# Altium schematic sheet main.SchDoc
size A4; SheetNumber: 1; SheetTotal: 5
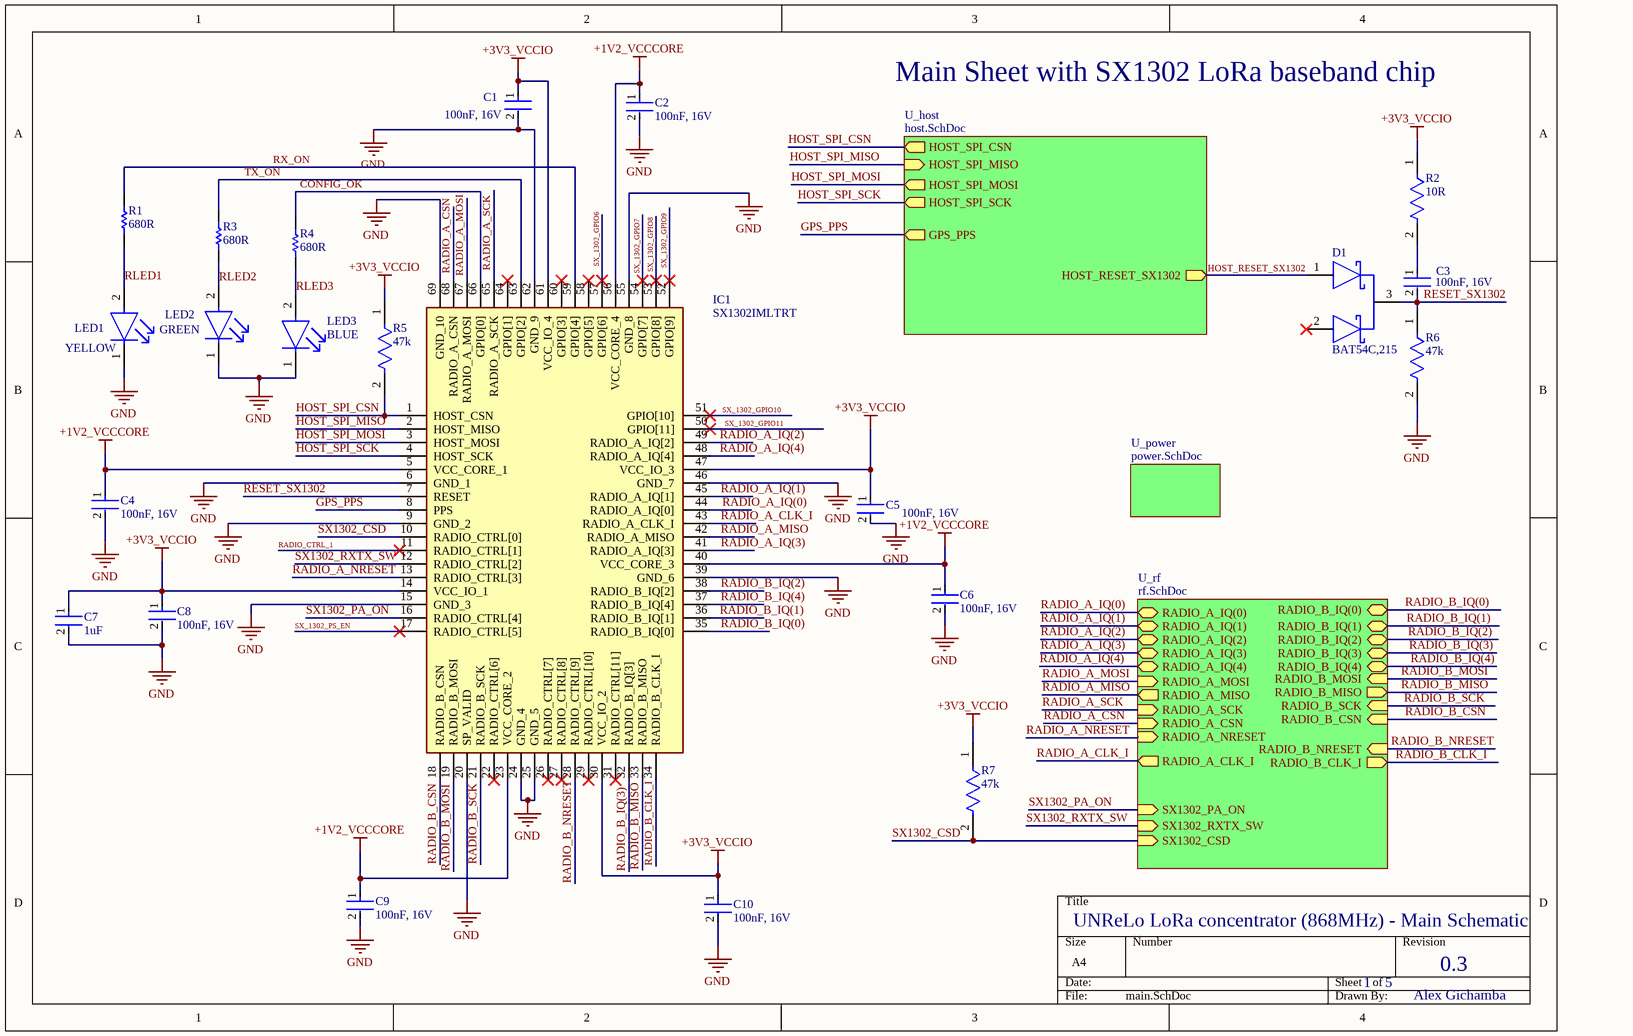
[diagram p0: main.SchDoc]

## Parts
C1  100nF, 16V  [FP-CC0603-DA-MFG]
C2  100nF, 16V  [FP-CC0603-DA-MFG]
C3  100nF, 16V  [FP-CC0603-DA-MFG]
C4  100nF, 16V  [FP-CC0603-DA-MFG]
C5  100nF, 16V  [FP-CC0603-DA-MFG]
C6  100nF, 16V  [FP-CC0603-DA-MFG]
C7  1uF  [FP-CL21-IPC_A]
C8  100nF, 16V  [FP-CC0603-DA-MFG]
C9  100nF, 16V  [FP-CC0603-DA-MFG]
C10  100nF, 16V  [FP-CC0603-DA-MFG]
D1  BAT54C,215  [FP-SOT23-MFG]
IC1  SX1302IMLTRT  [QFN35P700X700X80-69N-D]
LED1  YELLOW  [FP-SML-D12-MFG]
LED2  GREEN  [FP-LTST-C171GKT-MFG]
LED3  BLUE  [FP-6_541-5094_01-4-MFG]
R1  680R  [RESC2013X70X40ML20T20]
R2  10R  [FP-ERJ3EK-MFG]
R3  680R  [RESC2013X70X40ML20T20]
R4  680R  [RESC2013X70X40ML20T20]
R5  47k  [FP-RMCF0805-IPC_B]
R6  47k  [FP-RMCF0805-IPC_B]
R7  47k  [FP-RMCF0805-IPC_B]

## Sub-sheets
U_host = host.SchDoc: HOST_SPI_MOSI (out), HOST_SPI_MISO (in), HOST_SPI_CSN (out), HOST_SPI_SCK (out), HOST_RESET_SX1302 (out), GPS_PPS (out)
U_power = power.SchDoc: no entries
U_rf = rf.SchDoc: RADIO_A_IQ(0) (bidir), RADIO_A_IQ(1) (bidir), RADIO_A_IQ(4) (bidir), RADIO_A_IQ(3) (bidir), RADIO_A_IQ(2) (bidir), RADIO_B_IQ(2) (bidir), RADIO_B_IQ(4) (bidir), RADIO_B_IQ(1) (bidir), RADIO_B_IQ(0) (bidir), RADIO_B_IQ(3) (bidir), RADIO_A_SCK (in), RADIO_A_MOSI (in), RADIO_A_MISO (out), RADIO_A_NRESET (in), RADIO_A_CSN (in), RADIO_B_CSN (in), RADIO_B_SCK (in), RADIO_B_MOSI (in), RADIO_B_MISO (out), RADIO_B_NRESET (in), SX1302_CSD (in), SX1302_RXTX_SW (in), SX1302_PA_ON (in), RADIO_B_CLK_I (out), RADIO_A_CLK_I (out)

## Nets
+1V2_VCCCORE: C2.1 C4.1 C6.1 C9.1 IC1.5(VCC_CORE_1) IC1.23(VCC_CORE_2) IC1.40(VCC_CORE_3) IC1.56(VCC_CORE_4)
+3V3_VCCIO: C1.1 C5.1 C7.1 C8.1 C10.1 IC1.14(VCC_IO_1) IC1.30(VCC_IO_2) IC1.47(VCC_IO_3) IC1.61(VCC_IO_4) R2.1 R5.1 R7.1
GND: C1.2 C2.2 C4.2 C5.2 C6.2 C7.2 C8.2 C9.2 C10.2 IC1.6(GND_1) IC1.9(GND_2) IC1.15(GND_3) IC1.20(SP_VALID) IC1.24(GND_4) IC1.25(GND_5) IC1.39(GND_6) IC1.46(GND_7) IC1.55(GND_8) IC1.62(GND_9) IC1.69(GND_10) LED1.1(C) LED2.1(C) LED3.1(C) R6.2
CONFIG_OK: IC1.66(GPIO[0]) R4.2
GPS_PPS: IC1.8(PPS) ; sheet U_host/GPS_PPS
HOST_RESET_SX1302: D1.1(1_ANODE) ; sheet U_host/HOST_RESET_SX1302
HOST_SPI_CSN: IC1.1(HOST_CSN) R5.2 ; sheet U_host/HOST_SPI_CSN
HOST_SPI_MISO: IC1.2(HOST_MISO) ; sheet U_host/HOST_SPI_MISO
HOST_SPI_MOSI: IC1.3(HOST_MOSI) ; sheet U_host/HOST_SPI_MOSI
HOST_SPI_SCK: IC1.4(HOST_SCK) ; sheet U_host/HOST_SPI_SCK
RADIO_A_CLK_I: IC1.43(RADIO_A_CLK_I) ; sheet U_rf/RADIO_A_CLK_I
RADIO_A_CSN: IC1.68(RADIO_A_CSN) ; sheet U_rf/RADIO_A_CSN
RADIO_A_IQ(0): IC1.44(RADIO_A_IQ[0]) ; sheet U_rf/RADIO_A_IQ(0)
RADIO_A_IQ(1): IC1.45(RADIO_A_IQ[1]) ; sheet U_rf/RADIO_A_IQ(1)
RADIO_A_IQ(2): IC1.49(RADIO_A_IQ[2]) ; sheet U_rf/RADIO_A_IQ(2)
RADIO_A_IQ(3): IC1.41(RADIO_A_IQ[3]) ; sheet U_rf/RADIO_A_IQ(3)
RADIO_A_IQ(4): IC1.48(RADIO_A_IQ[4]) ; sheet U_rf/RADIO_A_IQ(4)
RADIO_A_MISO: IC1.42(RADIO_A_MISO) ; sheet U_rf/RADIO_A_MISO
RADIO_A_MOSI: IC1.67(RADIO_A_MOSI) ; sheet U_rf/RADIO_A_MOSI
RADIO_A_NRESET: IC1.13(RADIO_CTRL[3]) ; sheet U_rf/RADIO_A_NRESET
RADIO_A_SCK: IC1.65(RADIO_A_SCK) ; sheet U_rf/RADIO_A_SCK
RADIO_B_CLK_I: IC1.34(RADIO_B_CLK_I) ; sheet U_rf/RADIO_B_CLK_I
RADIO_B_CSN: IC1.18(RADIO_B_CSN) ; sheet U_rf/RADIO_B_CSN
RADIO_B_IQ(0): IC1.35(RADIO_B_IQ[0]) ; sheet U_rf/RADIO_B_IQ(0)
RADIO_B_IQ(1): IC1.36(RADIO_B_IQ[1]) ; sheet U_rf/RADIO_B_IQ(1)
RADIO_B_IQ(2): IC1.38(RADIO_B_IQ[2]) ; sheet U_rf/RADIO_B_IQ(2)
RADIO_B_IQ(3): IC1.32(RADIO_B_IQ[3]) ; sheet U_rf/RADIO_B_IQ(3)
RADIO_B_IQ(4): IC1.37(RADIO_B_IQ[4]) ; sheet U_rf/RADIO_B_IQ(4)
RADIO_B_MISO: IC1.33(RADIO_B_MISO) ; sheet U_rf/RADIO_B_MISO
RADIO_B_MOSI: IC1.19(RADIO_B_MOSI) ; sheet U_rf/RADIO_B_MOSI
RADIO_B_NRESET: IC1.28(RADIO_CTRL[9]) ; sheet U_rf/RADIO_B_NRESET
RADIO_B_SCK: IC1.21(RADIO_B_SCK) ; sheet U_rf/RADIO_B_SCK
RADIO_CTRL_1: IC1.11(RADIO_CTRL[1])
RESET_SX1302: C3.2 D1.3(COMMON_CATHODE) IC1.7(RESET) R6.1
RLED1: LED1.2(A) R1.1
RLED2: LED2.2(A) R3.1
RLED3: LED3.2(A) R4.1
RX_ON: IC1.59(GPIO[4]) R1.2
SX1302_CSD: IC1.10(RADIO_CTRL[0]) R7.2 ; sheet U_rf/SX1302_CSD
SX1302_PA_ON: IC1.16(RADIO_CTRL[4]) ; sheet U_rf/SX1302_PA_ON
SX1302_RXTX_SW: IC1.12(RADIO_CTRL[2]) ; sheet U_rf/SX1302_RXTX_SW
SX_1302_GPIO6: IC1.57(GPIO[6])
SX_1302_GPIO7: IC1.54(GPIO[7])
SX_1302_GPIO8: IC1.53(GPIO[8])
SX_1302_GPIO9: IC1.52(GPIO[9])
SX_1302_GPIO10: IC1.51(GPIO[10])
SX_1302_GPIO11: IC1.50(GPIO[11])
SX_1302_PS_EN: IC1.17(RADIO_CTRL[5])
TX_ON: IC1.63(GPIO[2]) R3.2
NetC3_1: C3.1 R2.2

Not connected (* = marked no-connect by the designer): D1 2(2_ANODE)*; IC1 22(RADIO_CTRL[6])* 26(RADIO_CTRL[7])* 27(RADIO_CTRL[8])* 29(RADIO_CTRL[10])* 31(RADIO_CTRL[11])* 58(GPIO[5])* 60(GPIO[3])* 64(GPIO[1])*

## Notes on the sheet
- Main Sheet with SX1302 LoRa baseband chip
- UNReLo LoRa concentrator (868MHz) - Main Schematic
- 1
- 5
- 0.3
- Alex Gichamba

## Library data of the parts
C1-C6 C8-C10 = CMP-2100-03601-2: CAP CER 0.1UF 50V X7R 0603; Manufacturer: YAGEO; Manufacturer Part Number: CC0603KRX7R9BB104; Material: Ceramic; Temperature Coefficient: 15%; Tolerance: 0.1; Height: 0.9mm; Voltage: 50 V; ComponentLink2Description: Datasheet; Device Class L2: Capacitors; Temperature Range High: +125°C; Category: Cap; Capacitance: 100 nF; Footprint Url: http://www.yageo.com/exep/pages/download/literatures/UPY-C_GEN_24.pdf; ComponentLink2URL: http://www.yageo.com/documents/recent/UPY-GPHC_X7R_6.3V-to-50V_18.pdf; Package: CC0603-DA; Temperature: -55°C to +125°C; Voltage Rating: 50 V; Temperature Characteristic: X7R; Device Class L1: Passive Components; Temperature Range Low: -55°C; RoHS: TRUE; Automotive: No; Value: 100 nF; Device Class L3: Ceramic Capacitors; Octopart: https://octopart.com/cc0603krx7r9bb104-yageo-42244635; Mouser Description: Multilayer Ceramic Capacitor, CC Series, 0.1 - F, - 10%, X7R, 50 V, 0603 [1608 Metric]; Lead Free: Yes; Digikey Description: CAP CER 0.1UF 50V X7R 0603
C7 = CMP-13271-003098-1: CL21 Series 0805 1uF 16V ±10% Tolerance X7R Multilayer Ceramic Chip Capacitor; Case Code (Metric): 2012; Width: 0.049inch; Thickness: 0.053inch; Voltage Rating: 16V; Max Operating Temperature: 125°C; Case Code (Imperial): 0805; Height: 1.25mm; Length: 2mm; Case/Package: 0805; Lead Free: Lead Free; Mount: Surface Mount; Capacitance: 1uF; Tolerance: 10%; Voltage Rating (DC): 16V; Min Operating Temperature: -55°C; Contact Plating: Tin; Depth: 1.25mm; Packaging: Tape and Reel; Package Quantity: 1; Voltage: 16V; Dielectric: X7R; Radiation Hardening: No
D1 = CMP-14398-000007-1: DIODE ARRAY SCHOTTKY 30V SOT23; Manufacturer: Nexperia; Automotive Grade: Grade 0; Peak Reverse Current: 2uA; Forward Current: 200mA; Max Surge Forward Current: 600mA; Value: 10pF; Max Junction Temp: +150°C; Lead Free: Yes; Automotive: Yes; Device Class L1: Discrete Semiconductors; Digikey Description: DIODE ARRAY SCHOTTKY 30V SOT23; Reverse Voltage: 30V; ComponentLink2URL: https://assets.nexperia.com/documents/data-sheet/BAT54_SER.pdf; Device Class L2: Diodes; Category: Diode; Octopart: https://octopart.com/bat54c%2C215-nexperia-78738945; Package: SOT23; Mouser Description: Schottky Diodes, Rectifiers - Arrays SOT-23 (TO-236AB) 30V 200mA (DC) Surface Mount; RoHS: TRUE; Manufacturer Part Number: BAT54C,215; Temperature: to +150°C; Ambient Temperature Range Low: -55°C; Height: 1.1mm; Device Class L3: Schottky Diodes; Temperature Range High: +150°C; Footprint Url: https://assets.nexperia.com/documents/outline-drawing/SOT23.pdf; Capacitance: 10pF; Ambient Temperature Range High: +150°C; Ipc Land Pattern Name: SOT95P230X100-3; ComponentLink2Description: Datasheet
IC1 = CMP-009-000004-1: Integrated Circuit; Manufacturer_Name: SEMTECH; Mouser Part Number: 947-SX1302IMLTRT; Datasheet Link: https://datasheet.datasheetarchive.com/originals/distributors/Datasheets_SAMA/c18cc298abe30af156b2783e16147acc.pdf; Design Item ID: SX1302IMLTRT; Mouser Price/Stock: https://www.mouser.co.uk/ProductDetail/Semtech/SX1302IMLTRT?qs=bZr6mbWTK5nALa%252B96PTK0Q%3D%3D; Height: 0.8mm; Component Type: Standard; Pin Count: 69; Source: SamacSys.SchLib; Manufacturer_Part_Number: SX1302IMLTRT
LED1 = CMP-08952-000005-1: LED YLW/GREEN DIFFUSED 1608 SMD; Manufacturer Part Number: SML-D12M1WT86; Manufacturer: Rohm; Led Orientation: Top View; Forward Voltage: 2.2V; Power Dissipation: 54mW; Wavelength: 572nm; Colour: Green; Reverse Voltage: 5V; Forward Current: 20mA; Luminous Intensity: 30mcd; RoHS: TRUE; Package: SML-D12; Temperature Range Low: -40°C; Device Class L3: unset; Temperature Range High: +85°C; Device Class L2: LEDs; Category: Diode; Device Class L1: Optoelectronics; Digikey Description: LED YLW/GREEN DIFFUSED 1608 SMD; Temperature: -40°C to +85°C; ComponentLink2Description: Datasheet; Automotive: No; Height: 0.65mm; Lead Free: Yes; Octopart: https://octopart.com/sml-d12m1wt86-rohm-70837112; ComponentLink2URL: https://www.rohm.com/datasheet/SML-D12M1W
LED2 = CMP-22017-000007-1: LED GREEN CLEAR CHIP SMD; Luminous Intensity: 12mcd; Lens Color: Colorless; Dominant Wavelength: 569nm; Number of LEDs: 1; Power Dissipation: 100mW; Viewing Angle: 130°; Reverse Voltage: 5V; Test Current: 10mA; Forward Voltage: 2.1V; Wavelength: 585nm; Lens Style: Diffused; Forward Current: 30mA; Height: 0.8mm; Mount: Surface Mount; Package Quantity: 1; Length: 2mm; Case Code (Metric): 2012; Number of Pins: 2; Number of Elements: 1; Packaging: Tape and Reel; Color: Green; Min Operating Temperature: -55°C; Case/Package: 0805; Power Rating: 100mW; Max Operating Temperature: 85°C; Radiation Hardening: No; Depth: 1.25mm; Lens Transparency: Clear; Width: 1.25mm; Lead Free: Lead Free; Case Code (Imperial): 0805; Illumination Color: Green
LED3 = CMP-02520-000013-1: LED BLUE 0603 SMD; Manufacturer Part Number: VLMB1300-GS08; Manufacturer: Vishay Semiconductor Opto Division; Forward Current: 20mA; Wavelength: 475nm; Viewing Angle: 130°; Forward Voltage: 3.8V; Power Dissipation: 76mW; Luminous Intensity: 28-180mcd; Led Orientation: Top View; Peak Emmision Wavelength: 468nm; RoHS: TRUE; ComponentLink2URL: http://www.vishay.com/docs/82437/vlmo1300.pdf; Ambient Temperature Range Low: -20°C; ComponentLink2Description: Datasheet; Mouser Description: LED; SMD; 0603; blue; 28-180mcd; 1.6x0.8x0.8mm; 130°; 2.8÷3.8V; 20mA; Package: 6.541-5094.01-4; Device Class L3: unset; Automotive: No; Temperature: -20°C to +80°C; Colour: Blue; Digikey Description: LED BLUE 0603 SMD; Device Class L2: LEDs; Temperature Range Low: -20°C; Lead Free: Yes; Category: Diode; Device Class L1: Optoelectronics; Height: 1mm; Octopart: https://octopart.com/vlmb1300-gs08-vishay-22022408; Temperature Range High: +80°C; Ambient Temperature Range High: +80°C
R1 R3 R4 = CMP-2001-00566-1: Part Number: ERJ6ENF6800V; Manufacturer: Panasonic
R2 = CMP-2000-00195-2: RES SMD 10 OHM 1% 1/10W 0603; Manufacturer Part Number: ERJ-3EKF10R0V; Manufacturer: Panasonic; Resistance: 10Ω; Voltage Rating: 75V; Value: 10Ω; Power: 100mW; Power Rating: 0.1W; Temperature Coefficient: 100ppm/°C; Automotive Grade: Grade 0; Lead Free: Yes; Device Class L1: Passive Components; Digikey Description: RES SMD 10 OHM 1% 1/10W 0603; Octopart: https://octopart.com/erj-3ekf10r0v-panasonic-55403649; Automotive: Yes; ComponentLink2URL: https://b2b-api.panasonic.eu/file_stream/pids/fileversion/1263; Height: 0.55mm; Temperature Range High: +155°C; Footprint Url: https://industrial.panasonic.com/cdbs/www-data/pdf/RDA0000/DMA0000COL17.pdf; Temperature: -55°C to +155°C; Tolerance: 1%; ComponentLink2Description: Datasheet; Package: ERJ3EK; Device Class L2: Resistors; Category: Res; Ipc Land Pattern Name: RESC16080X45; RoHS: TRUE; Composition: Thick Film; Device Class L3: Chip SMD Resistors; Temperature Range Low: -55°C; Series: ERJ
R5-R7 = CMP-26527-006464-1: 47kΩ ±5% 0.125W 0805 Thick Film Chip Resistor AEC-Q200 compliant; Power Rating: 125mW; Working Voltage: 150V; Temperature Coefficient: 100ppm/°C; Resistance: 47kR; Length: 2mm; Max Operating Temperature: 155°C; Case Code (Imperial): 0805; Min Operating Temperature: -55°C; Radiation Hardening: No; Tolerance: 5%; Number of Terminations: 2; Technology: THICK FILM; Military Standard: Not; Max Power Dissipation: 125mW; RoHS Compliant: Yes; Case/Package: 0805; Mount: Surface Mount; Resistor Type: Thick Film; Packaging: Tape and Reel; Lead Free: Lead Free; Depth: 1.25mm; Width: 0.049inch; Case Code (Metric): 2012; Height: 0.026inch; Contact Plating: Tin; Construction: Rectangular; Series: RMCF; Features: Automotive AEC-Q200